# EAGLE design MicroView (EAGLE 6.5.0)
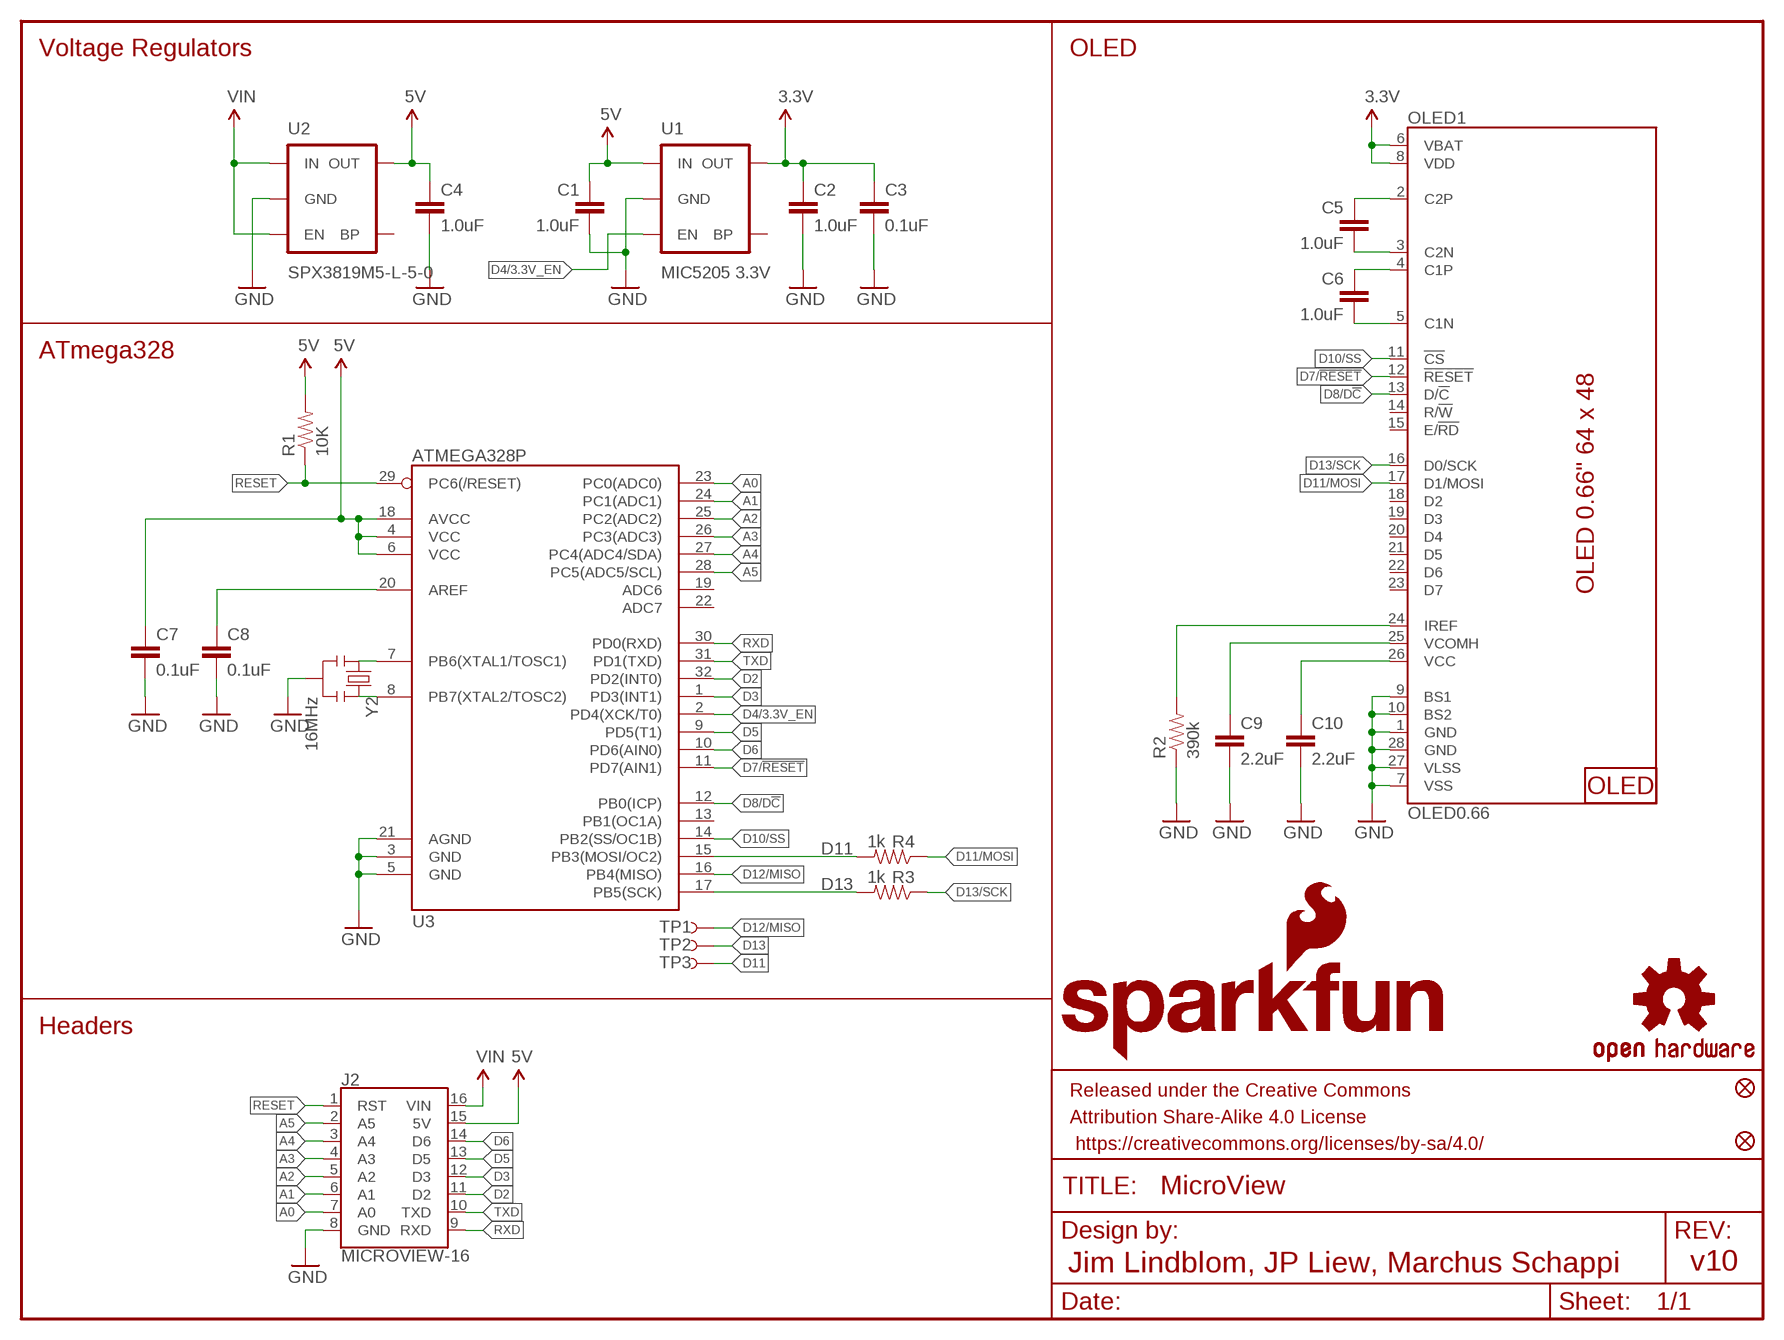
[diagram p0: schematic, sheet 1]

## Parts
C1  1.0uF  1.0UF-16V-10%(0603)  [0603-CAP]
C2  1.0uF  1.0UF-16V-10%(0603)  [0603-CAP]
C3  0.1uF  0.1UF-25V(+80/-20%)(0603)  [0603-CAP]
C4  1.0uF  1.0UF-16V-10%(0603)  [0603-CAP]
C5  1.0uF  1.0UF-16V-10%(0603)  [0603-CAP]
C6  1.0uF  1.0UF-16V-10%(0603)  [0603-CAP]
C7  0.1uF  0.1UF-25V(+80/-20%)(0603)  [0603-CAP]
C8  0.1uF  0.1UF-25V(+80/-20%)(0603)  [0603-CAP]
C9  2.2uF  2.2UF-10V-20%(0603)  [0603-CAP]
C10  2.2uF  2.2UF-10V-20%(0603)  [0603-CAP]
FID1  FIDUCIALUFIDUCIAL  [MICRO-FIDUCIAL]
FID3  FIDUCIALUFIDUCIAL  [MICRO-FIDUCIAL]
FRAME1  FRAME-LETTER  [CREATIVE_COMMONS]
J1  OLED_SCREEN  [OLED-SCREEN]
J2  MICROVIEW-16  [MV-DIP16]
LOGO1  OSHW-LOGOS  [OSHW-LOGO-S]
LOGO4  SFE_LOGO_NAME_FLAME.1_INCH  [SFE_LOGO_NAME_FLAME_.1]
OLED1  OLED0.66  [OLED-0.66-64X48]
R1  10K  10KOHM1/10W1%(0603)0603  [0603-RES]
R2  390k  RESISTOR0603  [0603-RES]
R3  1k  10KOHM1/10W1%(0603)0603  [0603-RES]
R4  1k  10KOHM1/10W1%(0603)0603  [0603-RES]
TP1  TEST-POINT3X5  [PAD.03X.05]
TP2  TEST-POINT3X5  [PAD.03X.05]
TP3  TEST-POINT3X5  [PAD.03X.05]
U1  MIC5205 3.3V  V_REG_MIC52053.3V  [SOT23-5]
U2  SPX3819M5-L-5-0  V_REG_MIC52195V  [SOT23-5]
U3  ATMEGA328P  ATMEGA328_SMT  [TQFP32-08]
Y2  16MHz  RESONATORSMD  [RESONATOR-SMD]

## Nets
3.3V: C2.1 C3.1 OLED1.6(VBAT) OLED1.8(VDD) U1.5(OUT)
5V: C1.1 C4.1 C7.1 J2.15(5V) R1.2 U1.1(IN) U2.5(OUT) U3.4(VCC) U3.6(VCC) U3.18(AVCC)
A0: J2.7(A0) U3.23(PC0(ADC0))
A1: J2.6(A1) U3.24(PC1(ADC1))
A2: J2.5(A2) U3.25(PC2(ADC2))
A3: J2.4(A3) U3.26(PC3(ADC3))
A4: J2.3(A4) U3.27(PC4(ADC4/SDA))
A5: J2.2(A5) U3.28(PC5(ADC5/SCL))
C1N: C6.2 OLED1.5(C1N)
C1P: C6.1 OLED1.4(C1P)
C2N: C5.2 OLED1.3(C2N)
C2P: C5.1 OLED1.2(C2P)
D2: J2.11(D2) U3.32(PD2(INT0))
D3: J2.12(D3) U3.1(PD3(INT1))
D4/3.3V_EN: U1.3(EN) U3.2(PD4(XCK/T0))
D5: J2.13(D5) U3.9(PD5(T1))
D6: J2.14(D6) U3.10(PD6(AIN0))
D7/!RESET!: OLED1.12(!RESET!) U3.11(PD7(AIN1))
D8/D!C!: OLED1.13(D/!C!) U3.12(PB0(ICP))
D10/SS: OLED1.11(!CS!) U3.14(PB2(SS/OC1B))
D11: R4.2 TP3.P$1 U3.15(PB3(MOSI/OC2))
D11/MOSI: OLED1.17(D1/MOSI) R4.1
D12/MISO: TP1.P$1 U3.16(PB4(MISO))
D13: R3.2 TP2.P$1 U3.17(PB5(SCK))
D13/SCK: OLED1.16(D0/SCK) R3.1
GND: C1.2 C2.2 C3.2 C4.2 C7.2 C8.2 C9.2 C10.2 J2.8(GND) OLED1.1(GND) OLED1.7(VSS) OLED1.9(BS1) OLED1.10(BS2) OLED1.27(VLSS) OLED1.28(GND) R2.1 U1.2(GND) U2.2(GND) U3.3(GND) U3.5(GND) U3.21(AGND) Y2.2
N$1: C10.1 OLED1.26(VCC)
N$2: C9.1 OLED1.25(VCOMH)
N$3: OLED1.24(IREF) R2.2
N$8: U3.7(PB6(XTAL1/TOSC1)) Y2.1
N$9: U3.8(PB7(XTAL2/TOSC2)) Y2.3
N$10: C8.1 U3.20(AREF)
RESET: J2.1(RST) R1.1 U3.29(PC6(/RESET))
RXD: J2.9(RXD) U3.30(PD0(RXD))
TXD: J2.10(TXD) U3.31(PD1(TXD))
VIN: J2.16(VIN) U2.1(IN) U2.3(EN)
Unconnected: OLED1.14(R/!W!) OLED1.15(E/!RD!) OLED1.18(D2) OLED1.19(D3) OLED1.20(D4) OLED1.21(D5) OLED1.22(D6) OLED1.23(D7) U1.4(BP) U2.4(BP) U3.13(PB1(OC1A)) U3.19(ADC6) U3.22(ADC7)

## Notes on the sheet
- Voltage Regulators | OLED
- ATmega328
- Headers
- Jim Lindblom, JP Liew, Marchus Schappi | v10

## Library data of the parts
C1 C2 C4-C6 = SparkFun-Capacitors:1.0UF-16V-10%(0603): CAP-00868; PROD_ID: CAP-00868
C3 C7 C8 = SparkFun-Capacitors:0.1UF-25V(+80/-20%)(0603): CAP-00810 Ceramic Standard decoupling cap; PROD_ID: CAP-00810
C9 C10 = SparkFun-Capacitors:2.2UF-10V-20%(0603): CAP-07888; PROD_ID: CAP-07888
FID1 FID3 = SparkFun-Aesthetics:FIDUCIAL: Fiducial Alignment Points Various fiducial points for machine vision alignment.
FRAME1 = SparkFun-Aesthetics:FRAME-LETTER: Schematic Frame Standard 8.5x11 US Letter frame
J1 = microView-temp:OLED_SCREEN
J2 = microView-temp:MICROVIEW-16
LOGO1 = SparkFun-Aesthetics:OSHW-LOGO: Open Source Hardware Logo This logo indicates the piece of hardware it is found on incorporates a OSHW license and/or adheres to the definition of open source hardware found here: http://freedomdefined.org/OSHW
LOGO4 = SparkFun-Aesthetics:SFE_LOGO_NAME_FLAME: SFE Logo, name and flame This is the SparkFun full logo. The logo on the schematic will always be the same size; the package variant is the height of the flame part of the logo. Default layer for the logo on the board is tSilk.
OLED1 = microView-temp:OLED0.66
R1 = SparkFun-Resistors:10KOHM1/10W1%(0603): RES-00824; PROD_ID: RES-00824
R2 = SparkFun-Resistors:RESISTOR: Resistor Basic schematic elements and footprints for 0603, 1206, and PTH resistors.
R3 R4 = SparkFun-Resistors:10KOHM1/10W1%(0603): RES-00824; PROD_ID: RES-00824; VALUE: 10K
TP1-TP3 = SparkFun-Passives:TEST-POINT: Bare copper test points for troubleshooting or ICT
U1 = SparkFun-PowerIC:V_REG_MIC5205: V_REG MIC5219 Standard 3.3V and 5V 150mA LDO voltage regulator in SOT-23 layout. Micrel part MIC5205. BP (by-pass) pin is used to lower output noise with 470pF cap, may be left open.; PROD_ID: VREG-00822; VALUE: 3.3V/150mA
U2 = SparkFun-PowerIC:V_REG_MIC5219: V_REG MIC5219 Standard 3.3V and 5V 500mA LDO voltage regulator in SOT-23 layout. Micrel part MIC5219. BP (by-pass) pin is used to lower output noise with 470pF cap, may be left open.; PROD_ID: VREG-10107; VALUE: MIC5219 5V
U3 = SparkFun-DigitalIC:ATMEGA328_SMT: 32-Pin Atmega328 part Commonly used on Arduino compatible boards Available in QFP and QFN packages TQFP is IC-09069 QFN is non-stock; PROD_ID: IC-09069
Y2 = microView-temp:RESONATOR: Resonator Small SMD resonator. This is the itty bitty 10/20MHz resonators with built in caps. CSTCE10M0G55 and CSTCE20M0V53. Footprint has been reviewed closely but hasn't been tested yet.

## Board
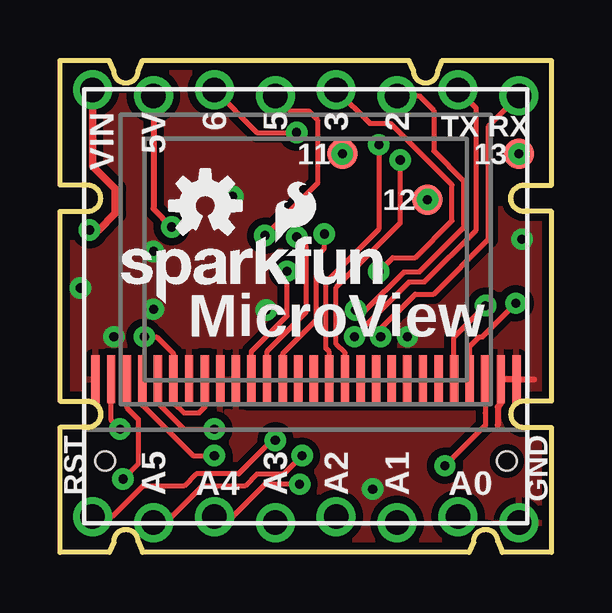
[diagram p1: board, top side]
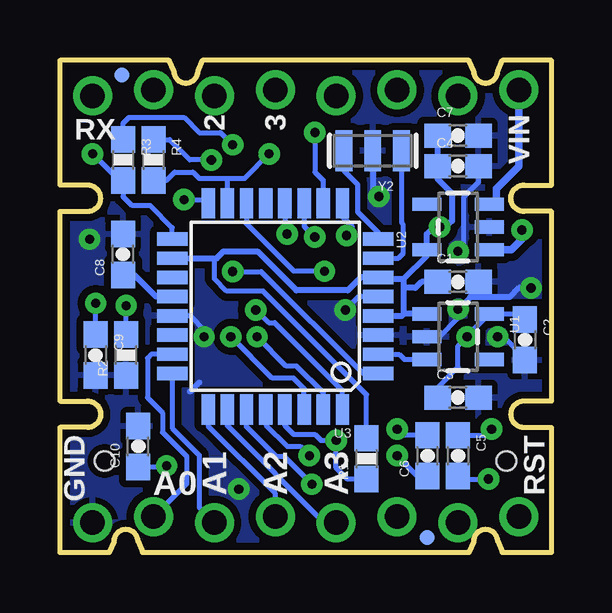
[diagram p2: board, bottom side, seen from below]

Size 20.5 x 20.5 mm. Coordinates in mm from the lower left corner, seen from the top.
Outline: 0,0 0,5.2 1.15,5.2 arc180 1.15,6.3 0,6.3 0,14.2 1.15,14.2 arc180 1.15,15.3 0,15.3 0,20.5 2.06,20.5 2.25,20.05 arc180 3.25,20.05 3.44,20.5 14.56,20.5 14.75,20.05 arc180 15.75,20.05 15.94,20.5 20.5,20.5 20.5,15.3 19.35,15.3 arc180 19.35,14.2 20.5,14.2 20.5,6.3 19.35,6.3 arc180 19.35,5.2 20.5,5.2 20.5,0 18.44,0 18.25,0.45 arc180 17.25,0.45 17.06,0 3.44,0 3.25,0.45 arc180 2.25,0.45 2.06,0 0,0
Copper layers (1*16): Top 0.035mm / dielectric 1.5mm / Bottom 0.035mm
Design rules "SparkFun-2-layer *": minimum track width 7mil, minimum drill 15mil, track to track 8mil, track to pad 8mil, pad to pad 8mil, via to via 8mil, smd to smd 8mil, copper to edge 8mil, drill to drill 8mil, minimum pad ring 12mil, minimum via ring 10mil, stop-mask expansion 4mil, vias tented up to drill 20mil, thermal gap 10mil

### Footprints (pad centres in the part's own frame; a part is rotated, then mirrored left to right if it is on the bottom)
0603-CAP = smd 1.1 x 1: 1 -0.85,0; 2 0.85,0
MICRO-FIDUCIAL = smd 0.635 x 0.635: 1 0,0
MV-DIP16 = drill 1.016: 1 -8.89,-8.763; 2 -6.35,-9.017; 3 -3.81,-8.763; 4 -1.27,-9.017; 5 1.27,-8.763; 6 3.81,-9.017; 7 6.35,-8.763; 8 8.89,-9.017; 9 8.89,8.763; 10 6.35,9.017; 11 3.81,8.763; 12 1.27,9.017; 13 -1.27,8.763; 14 -3.81,9.017; 15 -6.35,8.763; 16 -8.89,9.017
OLED-0.66-64X48 = smd 0.35 x 2: 1 0,0; 2 0.65,0; 3 1.3,0; 4 1.95,0; 5 2.6,0; 6 3.25,0; 7 3.9,0; 8 4.55,0; 9 5.2,0; 10 5.85,0; 11 6.5,0; 12 7.15,0; 13 7.8,0; 14 8.45,0; 15 9.1,0; 16 9.75,0; 17 10.4,0; 18 11.05,0; 19 11.7,0; 20 12.35,0; 21 13,0; 22 13.65,0; 23 14.3,0; 24 14.95,0; 25 15.6,0; 26 16.25,0; 27 16.9,0; 28 17.55,0 | hole 0.8: 17.15,-3.4; 0.4,-3.4
0603-RES = smd 1.1 x 1: 1 -0.85,0; 2 0.85,0
PAD.03X.05 = smd 1.27 x 1.27: P$1 0,0
SOT23-5 = smd 0.55 x 1.2: 1 -0.95,-1.3; 2 0,-1.3; 3 0.95,-1.3; 4 0.95,1.3; 5 -0.95,1.3
TQFP32-08 = smd 1.27 x 0.559: 1 -4.293,2.8; 2 -4.293,2; 3 -4.293,1.2; 4 -4.293,0.4; 5 -4.293,-0.4; 6 -4.293,-1.2; 7 -4.293,-2; 8 -4.293,-2.8; 17 4.293,-2.8; 18 4.293,-2; 19 4.293,-1.2; 20 4.293,-0.4; 21 4.293,0.4; 22 4.293,1.2; 23 4.293,2; 24 4.293,2.8 | smd 0.559 x 1.27: 9 -2.8,-4.293; 10 -2,-4.293; 11 -1.2,-4.293; 12 -0.4,-4.293; 13 0.4,-4.293; 14 1.2,-4.293; 15 2,-4.293; 16 2.8,-4.293; 25 2.8,4.293; 26 2,4.293; 27 1.2,4.293; 28 0.4,4.293; 29 -0.4,4.293; 30 -1.2,4.293; 31 -2,4.293; 32 -2.8,4.293
RESONATOR-SMD = smd 0.7 x 1.7: 1 -1.2,0; 2 0,0; 3 1.2,0

### Placement (x,y rotation side)
C1  3.9,11.27 0 bottom
C2  1.11,8.85 270 bottom
C3  3.9,6.44 0 bottom
C4  3.9,16.09 0 bottom
C5  3.9,4.03 270 bottom
C6  5.17,4.03 90 bottom
C7  3.9,17.36 0 bottom
C8  17.87,12.41 90 bottom
C9  19.01,8.22 270 bottom
C10  17.23,4.41 90 bottom
FID1  17.92,19.88 0 bottom
FID3  5.2,0.62 0 bottom
FRAME1  -8.8,-10.07 0 top  (outside the outline)
J1  10.25,10.25 0 top
J2  10.25,10.25 0 top
LOGO1  6.06,14.44 0 top
LOGO4  2.12,10.25 0 top
OLED1  1.49,7.2 0 top
R1  7.71,3.9 90 bottom
R2  17.74,8.22 90 bottom
R3  17.87,16.35 270 bottom
R4  16.6,16.35 270 bottom
TP1  15.33,14.7 0 top
TP2  19.14,16.6 0 top
TP3  11.77,16.6 0 top
U1  3.9,8.98 270 bottom
U2  3.9,13.55 90 bottom
U3  11.52,10.25 180 bottom
Y2  7.46,16.73 180 bottom

### Tracks (layer width: path | path; a pad name or v marks a point on that pad's centre or on a via)
3.3V  (via drill 0.38)
  Top 0.203: OLED1.8 6.04,6.04 5.8,5.8 5.17,5.8 4.74,6.24 OLED1.6 4.74,8.27 4.03,8.98 v3.52,8.98
  Bottom 0.203: v3.52,8.98 3.26,9.23 3.26,9.27 U1.5 1.33,9.93 C2.1 | 3.65,8.73 3.65,8.85 v3.52,8.98 | C3.1 4.75,6.86 3.9,7.71 3.9,8.6 v3.52,8.98
5V  (via drill 0.38)
  Top 0.254: J2.15 3.9,14.31 v4.66,13.55
  Bottom 0.203: R1.2 7.71,6.57 12.03,10.88 13.55,10.88 14.06,11.39 14.06,12.15 13.96,12.25
  Bottom 0.254: U3.18 13.96,12.25 13.68,12.54 12.27,12.54 10.64,10.91 8.5,10.91 7.96,11.45 U3.6 7.17,11.39 6.17,11.39 | U3.4 6.25,9.85 6.17,9.93 | U1.1 6.17,9.93 | C7.1 C4.1 4.75,15.54 4.15,14.95 4.15,13.81 4.41,13.55 v4.66,13.55 4.92,13.55 5.2,13.27 U2.5 5.2,12.36 6.17,11.39 | 6.17,11.39 6.17,11.01 | 6.17,11.01 6.17,9.93 | C1.1 5.42,11.27 5.68,11.01 6.17,11.01
A0
  Bottom 0.203: U3.23 16.7,8.25 16.85,8.09 16.85,6.44 16.22,5.8 16.22,4.99 15.2,3.98 15.2,2.88 J2.7
A1
  Bottom 0.203: U3.24 15.81,5.17 14.7,4.05 14.7,1.87 J2.6
A2
  Bottom 0.203: U3.25 14.32,5.25 11.52,2.45 J2.5
A3
  Bottom 0.203: U3.26 13.52,5.26 9.49,1.23 J2.4
A4  (via drill 0.38)
  Top 0.203: J2.3 7.2,1.49 8.55,2.83 v10,2.83
  Bottom 0.203: U3.27 12.72,5.23 11.47,3.98 11.14,3.98 v10,2.83
A5  (via drill 0.38)
  Top 0.203: J2.2 4.41,1.23 5.93,2.76 7.71,2.76 8.22,3.26 9.34,3.26 v10.1,4.03
  Bottom 0.203: U3.28 11.92,5.32 11.01,4.41 10.48,4.41 v10.1,4.03
C1N  (via drill 0.38)
  Top 0.203: OLED1.5 4.09,6.21 5.17,5.13 v6.44,5.13
  Bottom 0.203: C6.2 6.19,4.88 v6.44,5.13
C1P  (via drill 0.38)
  Top 0.203: OLED1.4 3.44,6.14 5.55,4.03 v6.44,4.03
  Bottom 0.203: C6.1 5.59,3.18 v6.44,4.03
C2N  (via drill 0.38)
  Top 0.203: 2.79,7.55 2.79,6.03 3.26,5.55 3.26,3.68 v2.63,3.05
  Top 0.254: OLED1.3 2.79,7.55
  Bottom 0.203: C5.2 3.77,3.05 v2.63,3.05
C2P  (via drill 0.38)
  Top 0.203: v2.5,5.13 2.14,5.5 OLED1.2
  Bottom 0.203: C5.1 2.76,4.88 v2.5,5.13
D2  (via drill 0.38)
  Top 0.203: v12.33,10.1 12.77,10.1 14.34,11.67 14.97,11.67 16.85,13.55 16.85,15.46 15.58,16.73 15.58,18.41 14.98,19.01 J2.11
  Bottom 0.203: U3.32 8.72,6.74 11.54,9.56 11.8,9.56 v12.33,10.1
D3  (via drill 0.38)
  Top 0.203: v13.3,11.7 13.88,12.28 14.82,12.28 16.35,13.81 16.35,15.3 13.78,17.87 12.92,17.87 J2.12
  Bottom 0.203: U3.1 7.86,7.45 12.1,11.7 v13.3,11.7
D4/3.3V_EN
  Bottom 0.203: U3.2 6.35,8.25 6.12,8.03 U1.3
D5  (via drill 0.38)
  Top 0.203: v8.55,13.2 10.76,15.41 10.76,18 10.38,18.38 9.62,18.38 J2.13
  Bottom 0.203: U3.9 8.72,13.98 8.32,13.58 8.32,13.43 v8.55,13.2
D6  (via drill 0.38)
  Top 0.203: v9.87,17.49 8.22,17.49 J2.14
  Bottom 0.203: U3.10 9.52,15.49 9.87,15.84 v9.87,17.49
D7/!RESET!  (via drill 0.38)
  Top 0.203: v9.88,13.14 10.25,12.77 10.25,10 8.64,8.38 OLED1.12
  Bottom 0.203: U3.11 10.32,13.58 v9.88,13.14
D8/D!C!  (via drill 0.38)
  Top 0.203: OLED1.13 9.29,8.27 10.68,9.67 10.68,12.31 11.03,12.65 v11.03,13.26
  Bottom 0.203: U3.12 11.12,13.37 11.03,13.27 v11.03,13.26
D10/SS  (via drill 0.38)
  Top 0.203: OLED1.11 7.99,8.37 9.47,9.85 v9.47,11.71
  Bottom 0.203: v9.47,11.71 10.74,11.71 12.72,13.69 U3.14 arc90 12.79,14.61
D11  (via drill 0.38)
  Bottom 0.203: R4.2 16.05,15.5 15.71,15.84 14.95,15.84 14.7,15.58 13.55,15.58 | U3.15 13.52,15.55 13.55,15.58 | 13.55,15.58 12.79,15.58 TP3.P$1
  other vias: 11.77,16.6
D11/MOSI  (via drill 0.38)
  Top 0.203: OLED1.17 11.89,8.31 11.52,8.68 11.52,11.04 14.19,13.7 v14.19,16.35
  Bottom 0.203: R4.1 15.93,17.2 15.08,16.35 v14.19,16.35
D12/MISO  (via drill 0.38)
  Bottom 0.203: TP1.P$1 14.47,14.7 U3.16
  other vias: 15.33,14.7
D13  (via drill 0.38)
  Bottom 0.203: U3.17 15.81,13.53 16.73,14.44 17.49,14.44 17.87,14.82 R3.2 18.04,15.5 TP2.P$1
  other vias: 19.14,16.6
D13/SCK  (via drill 0.38)
  Top 0.203: OLED1.16 11.24,8.35 11.09,8.5 11.09,11.24 13.3,13.45 v13.3,16.98
  Bottom 0.203: R3.1 17.87,17.87 17.62,18.12 15.33,18.12 14.7,17.49 13.81,17.49 v13.3,16.98
GND  (via drill 0.38)
  Top 0.254: 19.77,7.2 OLED1.28 18.38,7.2 18.38,6.19 18.25,6.06 18.25,5.3
  Bottom 0.203: U3.21 15.06,9.85 14.44,9.23 | U3.5 8.05,10.65 v8.6,10.1 | U1.2 4.66,8.98 3.9,9.74 v3.9,10.12 | 3.65,12.66 3.65,14.82 3.05,15.42 C4.2 | C2.2 1.11,8.09 1.99,8.98 v2.25,8.98
  Bottom 0.254: 15.08,6.69 14.7,7.08 | Y2.2 7.46,15.08 v7.2,14.82 | v0.85,11.01 1.36,11.01 1.74,10.63 3.39,10.63 v3.9,10.12
  other vias: 14.49,8.98 19.27,13.04 13.04,2.63 3.9,12.54
  pour Bottom (isolate 0.305): 20.5,0 20.5,20.5 0,20.5 0,0
  pour Top (isolate 0.305): 20.5,0 20.5,20.5 0,20.5 0,0
N$1  (via drill 0.38)
  Top 0.203: OLED1.26 17.74,5.81 17.74,5.8 17.74,5.3 v16.05,3.61
  Bottom 0.203: C10.1 16.1,3.56 v16.05,3.61
N$2  (via drill 0.38)
  Top 0.203: OLED1.25 17.09,8.58 17.49,8.98 17.62,8.98 v19.01,10.38
  Bottom 0.203: C9.1 v19.01,10.38
N$3  (via drill 0.38)
  Top 0.203: OLED1.24 16.44,8.97 v17.74,10.28
  Bottom 0.203: R2.2 v17.74,10.28
N$8
  Bottom 0.203: U3.7 6.4,12.25 6.19,12.46 6.19,13.67 6.26,13.74 Y2.1
N$9
  Bottom 0.203: 7.08,13.2 U3.8 7.23,13.32 8.09,14.19 8.09,15.33 8.66,15.89 Y2.3
N$10
  Bottom 0.254: C8.1 17.4,11.56 16.49,10.65 U3.20
RESET  (via drill 0.38)
  Top 0.203: J2.1 2.17,1.49 3.44,2.76 5.17,2.76 5.68,3.26 7.46,3.26 8.85,4.66 v8.98,4.66
  Bottom 0.203: U3.29 11.12,5.28 10.76,4.92 9.87,4.92 9.62,4.66 v8.98,4.66 8.98,3.52 8.51,3.05 R1.1 8,3.05
RXD  (via drill 0.38)
  Top 0.203: v13.37,8.98 13.37,9.31 14.82,10.76 15.58,10.76 17.87,13.04 17.87,17.74 J2.9
  Bottom 0.203: U3.30 10.32,6.81 10.76,7.25 11.65,7.25 v13.37,8.98
TXD  (via drill 0.38)
  Top 0.203: v12.28,8.98 14.57,11.27 15.2,11.27 17.36,13.43 17.36,18.51 J2.10
  Bottom 0.203: U3.31 9.52,6.65 10.63,7.76 11.06,7.76 v12.28,8.98
VIN  (via drill 0.38)
  Top 0.305: v1.23,13.43 1.61,13.43 2.31,14.12 2.31,15.14 1.36,16.09 J2.16
  Bottom 0.203: U2.3 2.31,14.5
  Bottom 0.305: U2.1 1.68,12.6 1.23,13.04 v1.23,13.43 | 2.31,14.5 2.31,15.14 1.36,16.09 J2.16

### Text on the board
tPlace: VIN | 5V | 6 | 5 | 3 | 2 | TX | RX | 11 | 13 | 12 | MicroView | A4 | A0 | RST | A5 | A3 | A2 | A1 | GND
bPlace: VIN | 3 | 2 | RX | A0 | RST | A3 | A2 | A1 | GND
tDocu: Jim Lindblom, JP Liew, Marcus Schappi